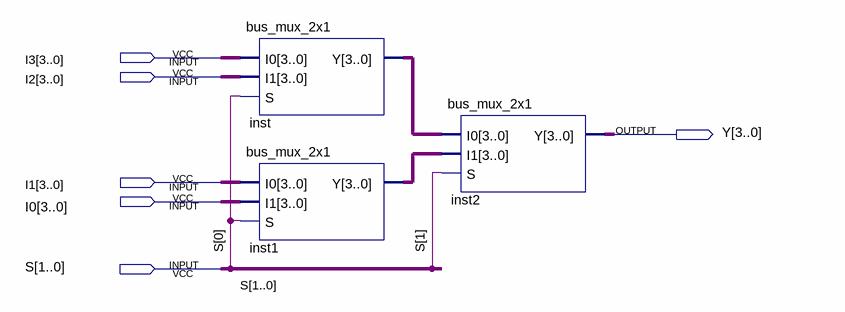
[diagram p0: schematic sheet]
// Quartus schematic BUS_MUX_4X1.bdf as structural Verilog: 3 symbols, 6 pins
module BUS_MUX_4X1 (
  input  [3:0] I3,
  input  [3:0] I2,
  input  [3:0] I1,
  input  [3:0] I0,
  input  [1:0] S,
  output [3:0] Y
);

  wire [3:0] inst1_y, inst_y;

  bus_mux_2x1 inst (.I0(I3), .I1(I2), .S(S[0]), .Y(inst_y));
  bus_mux_2x1 inst1 (.I0(I1), .I1(I0), .S(S[0]), .Y(inst1_y));
  bus_mux_2x1 inst2 (.I0(inst_y), .I1(inst1_y), .S(S[1]), .Y(Y));
endmodule
